# Altium schematic sheet MB1297_Peripherals.SchDoc: Peripherals
size A4; DocumentNumber: MB1297; Revision: D; SheetNumber: 10; SheetTotal: 11
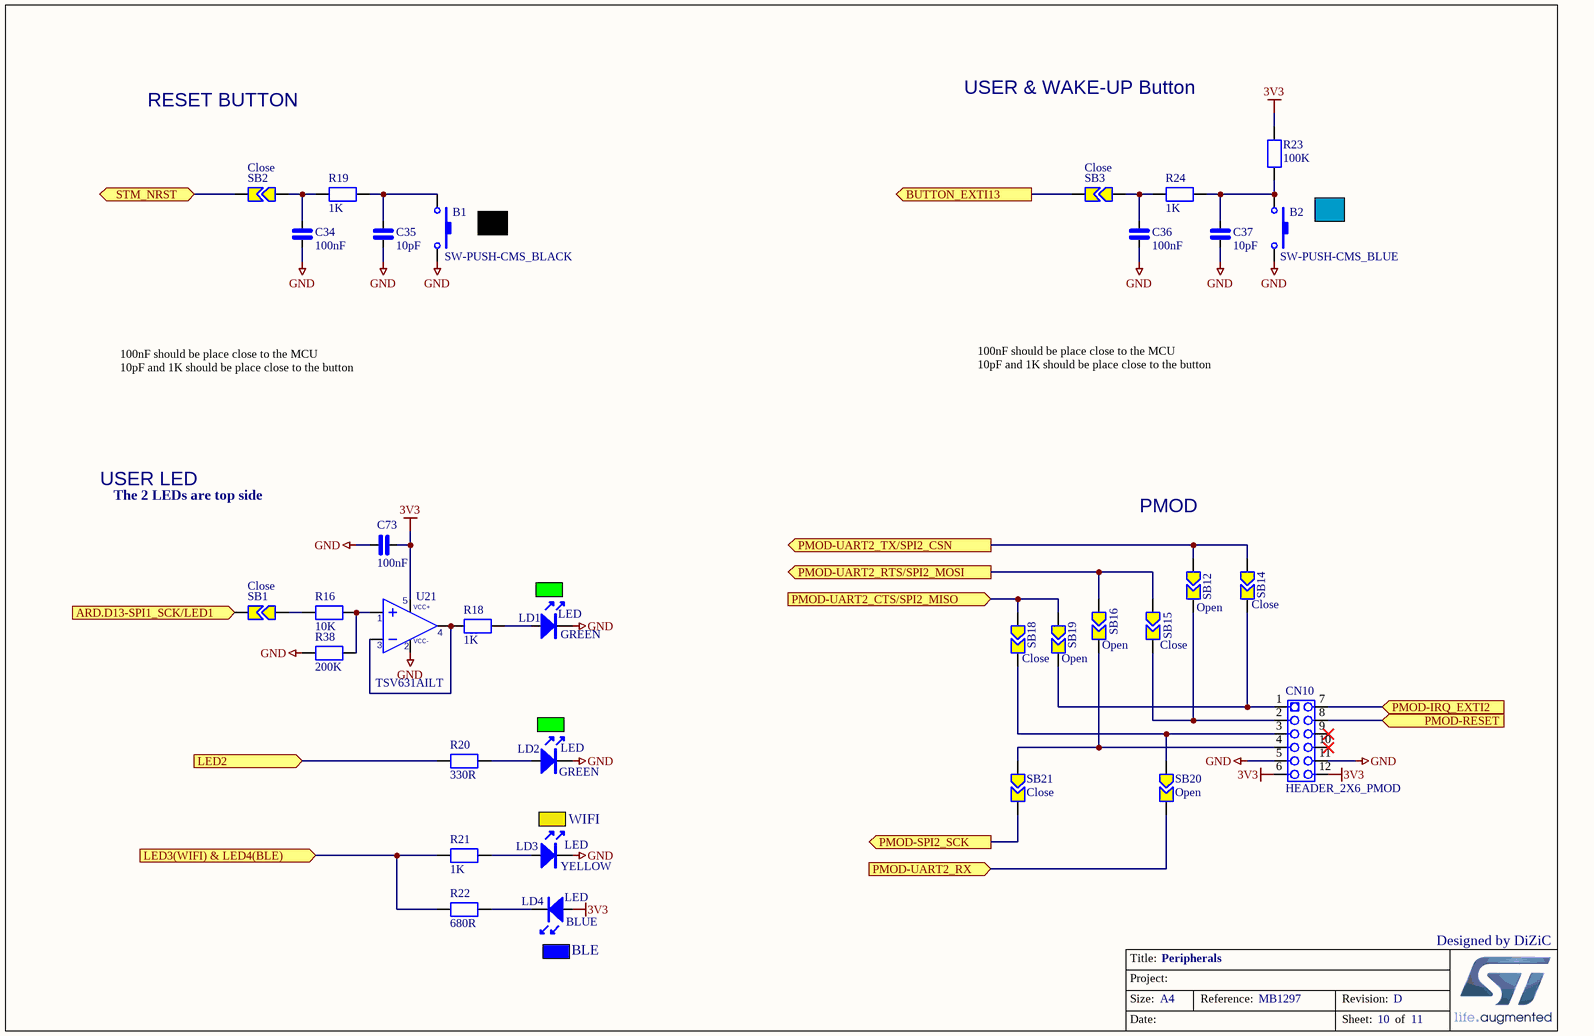
[diagram p0: MB1297_Peripherals.SchDoc]

## Parts
B1  SW-PUSH-CMS_BLACK  [SWI_WEALTHMETAL_TD-0341_4P - BACK]
B2  SW-PUSH-CMS_BLUE  [SWI_WEALTHMETAL_TD-0341_4P - BLUE]
C34  100nF  [0402_CAP_NPOL]
C35  10pF  [0402_CAP_NPOL]
C36  100nF  [0402_CAP_NPOL]
C37  10pF  [0402_CAP_NPOL]
C73  100nF  [0402_CAP_NPOL]
CN10  HEADER_2X6_PMOD  [Header F 2x6x2.54 TH H PMOD]
LD1  LED  Color: GREEN  [0603_LED_GREEN]
LD2  LED  Color: GREEN  [0603_LED_GREEN]
LD3  LED  Color: YELLOW  [0603_LED_Yellow]
LD4  LED  Color: BLUE  [0603_LED_Blue]
R16  10K  [0402_RES]
R18  1K  [0402_RES]
R19  1K  [0402_RES]
R20  330R  [0402_RES]
R21  1K  [0402_RES]
R22  680R  [0402_RES]
R23  100K  [0402_RES]
R24  1K  [0402_RES]
R38  200K  [0402_RES]
SB1  Close  [SB]
SB2  Close  [SB]
SB3  Close  [SB]
SB12  Open  [SB]
SB14  Close  [SB]
SB15  Close  [SB]
SB16  Open  [SB]
SB18  Close  [SB]
SB19  Open  [SB]
SB20  Open  [SB]
SB21  Close  [SB]
U21  TSV631AILT  [SOT23-5]

## Ports
ARD.D13-SPI1_SCK/LED1, BUTTON_EXTI13, LED2 (in), LED3(WIFI) & LED4(BLE), PMOD-IRQ_EXTI2, PMOD-RESET, PMOD-SPI2_SCK, PMOD-UART2_CTS/SPI2_MISO, PMOD-UART2_RTS/SPI2_MOSI, PMOD-UART2_RX, PMOD-UART2_TX/SPI2_CSN, STM_NRST

## Nets
3V3: C73.1 CN10.6 CN10.12 LD4.A R23.2 U21.5(V+)
GND: B1.2 B2.2 C34.2 C35.2 C36.2 C37.2 C73.2 CN10.5 CN10.11 LD1.K LD2.K LD3.K R38.1 U21.2(V-)
ARD.D13-SPI1_SCK/LED1: SB1.1 ; port ARD.D13-SPI1_SCK/LED1
BUTTON_EXTI13: SB3.1 ; port BUTTON_EXTI13
LED2: R20.1 ; port LED2
LED3(WIFI) & LED4(BLE): R21.1 R22.1 ; port LED3(WIFI) & LED4(BLE)
PMOD-IRQ_EXTI2: CN10.7 ; port PMOD-IRQ_EXTI2
PMOD-RESET: CN10.8 ; port PMOD-RESET
PMOD-SPI2_SCK: SB21.1 ; port PMOD-SPI2_SCK
PMOD-UART2_CTS/SPI2_MISO: SB18.2 SB19.2 ; port PMOD-UART2_CTS/SPI2_MISO
PMOD-UART2_RTS/SPI2_MOSI: SB15.2 SB16.2 ; port PMOD-UART2_RTS/SPI2_MOSI
PMOD-UART2_RX: SB20.1 ; port PMOD-UART2_RX
PMOD-UART2_TX/SPI2_CSN: SB12.2 SB14.2 ; port PMOD-UART2_TX/SPI2_CSN
STM_NRST: SB2.1 ; port STM_NRST
NetB1_1: B1.1 C35.1 R19.2
NetB2_1: B2.1 C37.1 R23.1 R24.2
NetC34_1: C34.1 R19.1 SB2.2
NetC36_1: C36.1 R24.1 SB3.2
NetCN10_1: CN10.1 SB14.1 SB19.1
NetCN10_2: CN10.2 SB12.1 SB15.1
NetCN10_3: CN10.3 SB18.1 SB20.2
NetCN10_4: CN10.4 SB16.1 SB21.2
NetLD1_A: LD1.A R18.2
NetLD2_A: LD2.A R20.2
NetLD3_A: LD3.A R21.2
NetLD4_K: LD4.K R22.2
NetR16_1: R16.1 SB1.2
NetR16_2: R16.2 R38.2 U21.1(IN+)
NetR18_1: R18.1 U21.3(IN-) U21.4(OUT)

Not connected (* = marked no-connect by the designer): CN10 9* 10*

## Notes on the sheet
- RESET BUTTON
- USER & WAKE-UP Button
- 100nF should be place close to the MCU
  10pF and 1K should be place close to the button
- USER LED
- The 2 LEDs are top side
- PMOD
- (near LD3) WIFI
- (near LD4) BLE
- Designed by DiZiC
- Title:
- Project:
- Size:
- Date:
- A4
- Reference:
- Sheet:
- Revision:
- of
- (in symbol TSV631AILT) VCC+; VCC-

## Library data of the parts
B1 B2 = SW-PB_2: Push-button SMD; Order code RS: 102-412
C34-C37 C73 = CAP_NPOL: Capacitor_not polarized
CN10 = HEADER_2X6_PMOD: PMOD Connector Warning Specific Pinout
LD1-LD4 = LED: Light-Emitting Diode; Part Number A: *
R16 R18-R24 R38 = RES: Resistor
SB1-SB3 SB12 SB14-SB16 SB18-SB21 = Strap2: Solder Jumper; Solder: YES; Published: 24-Mar-1999; Revision: July-2002: Re-released for DXP Platform.; Publisher: Altium Limited
U21 = TSV631AILT: TSV631AILT  Rail-to-rail input/output, 60 µA, 880 kHz, 5 V CMOS  operational amplifiers